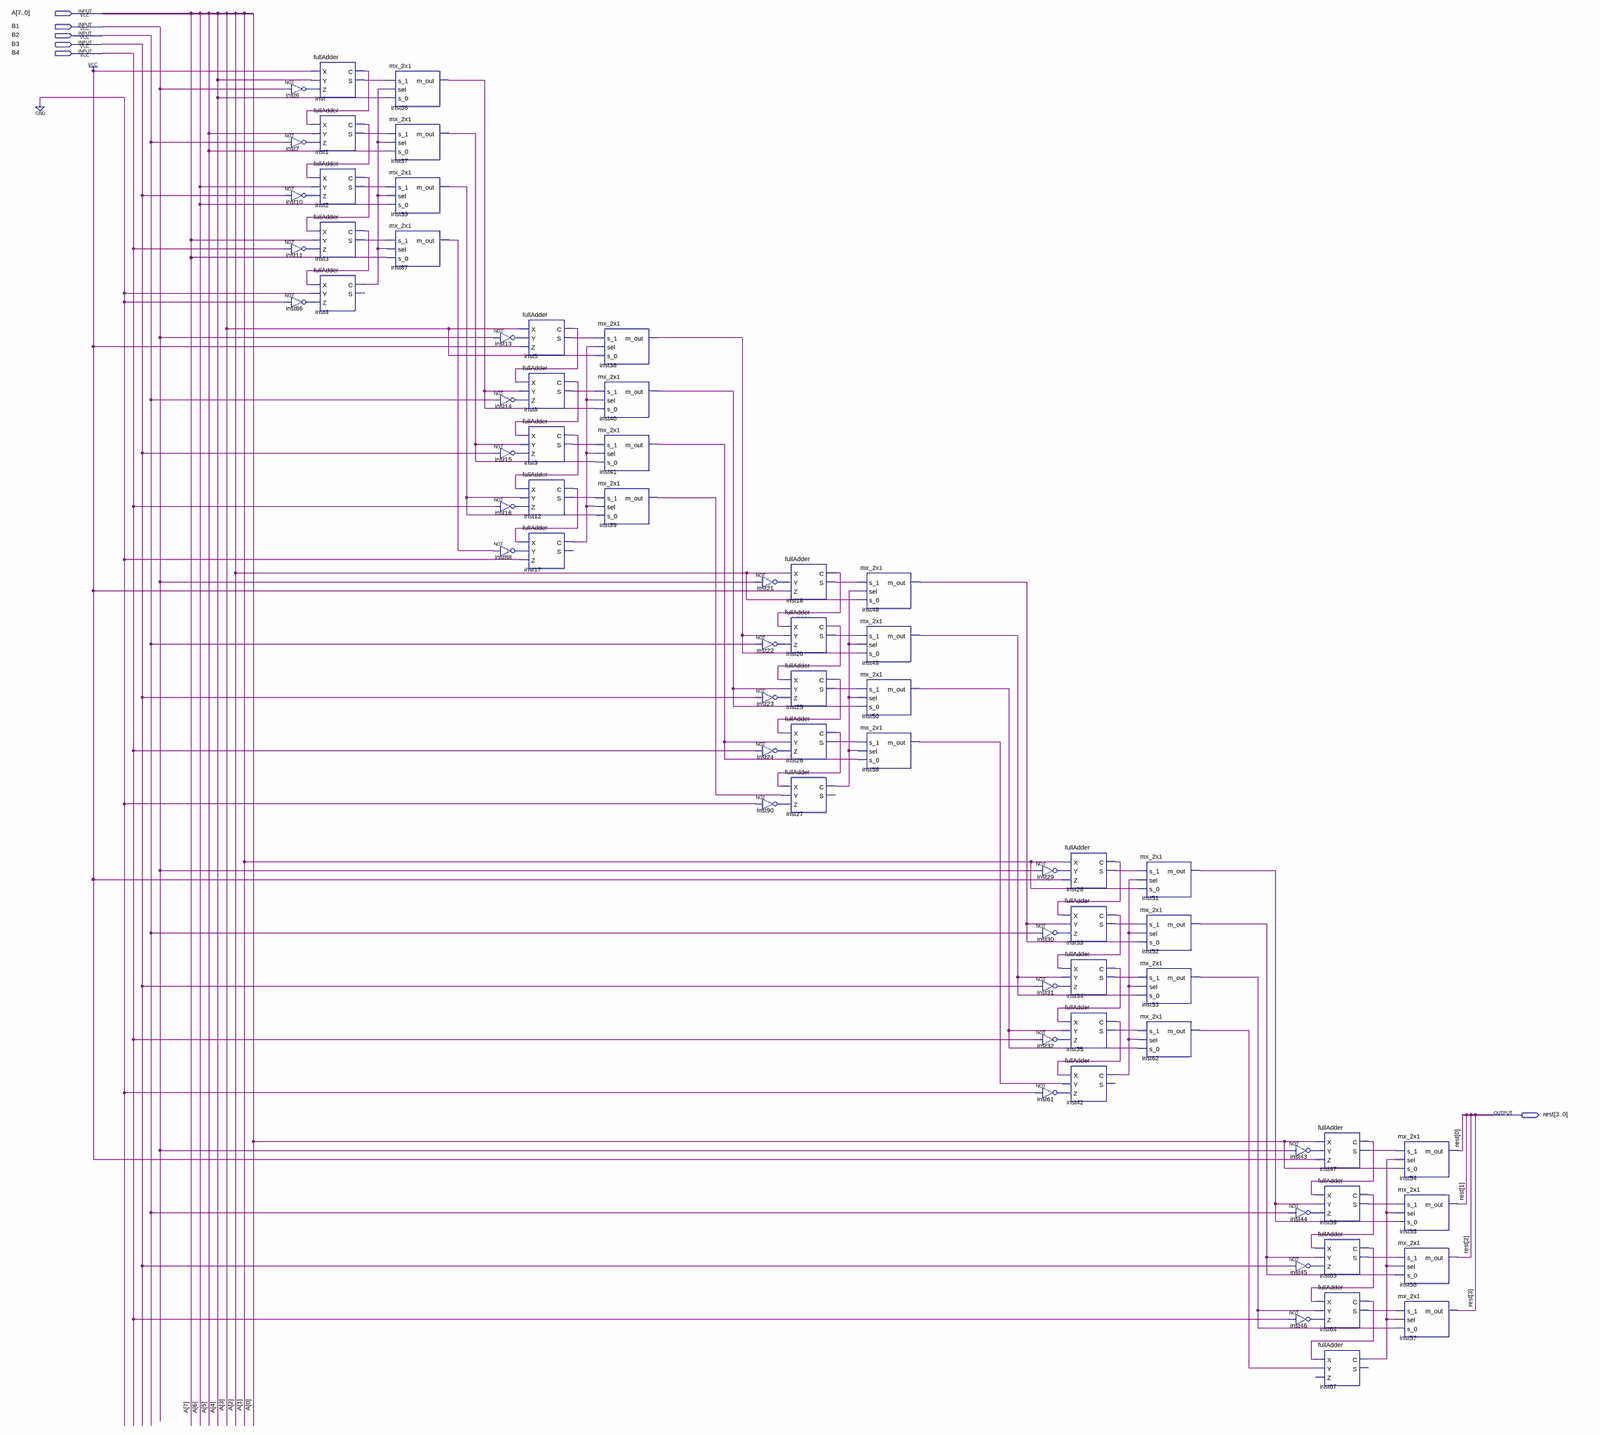
[diagram p0: schematic sheet, whole]
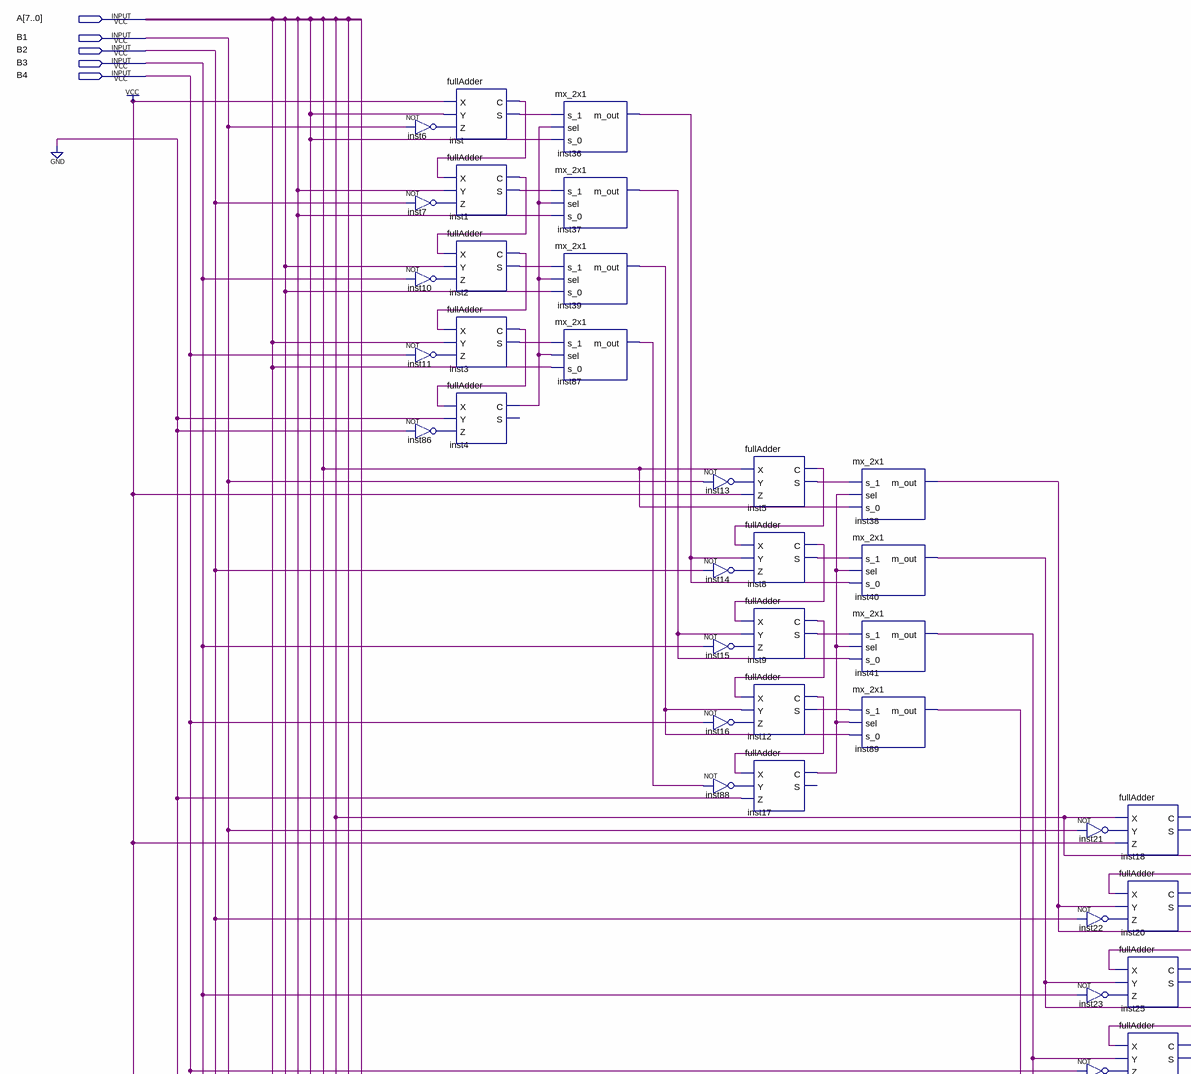
[diagram p1: schematic sheet, upper left part]
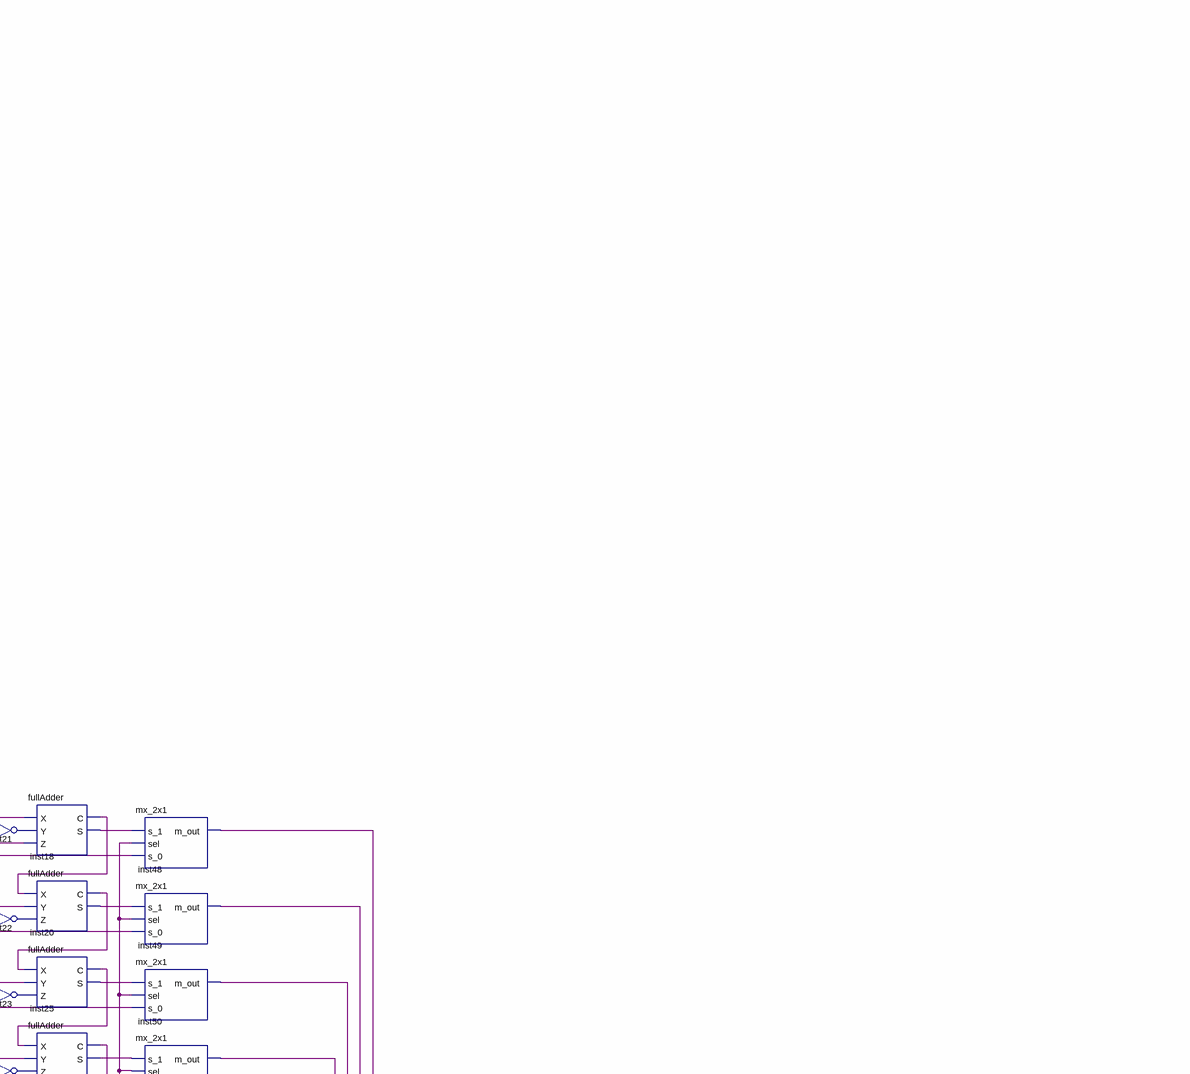
[diagram p2: schematic sheet, upper right part]
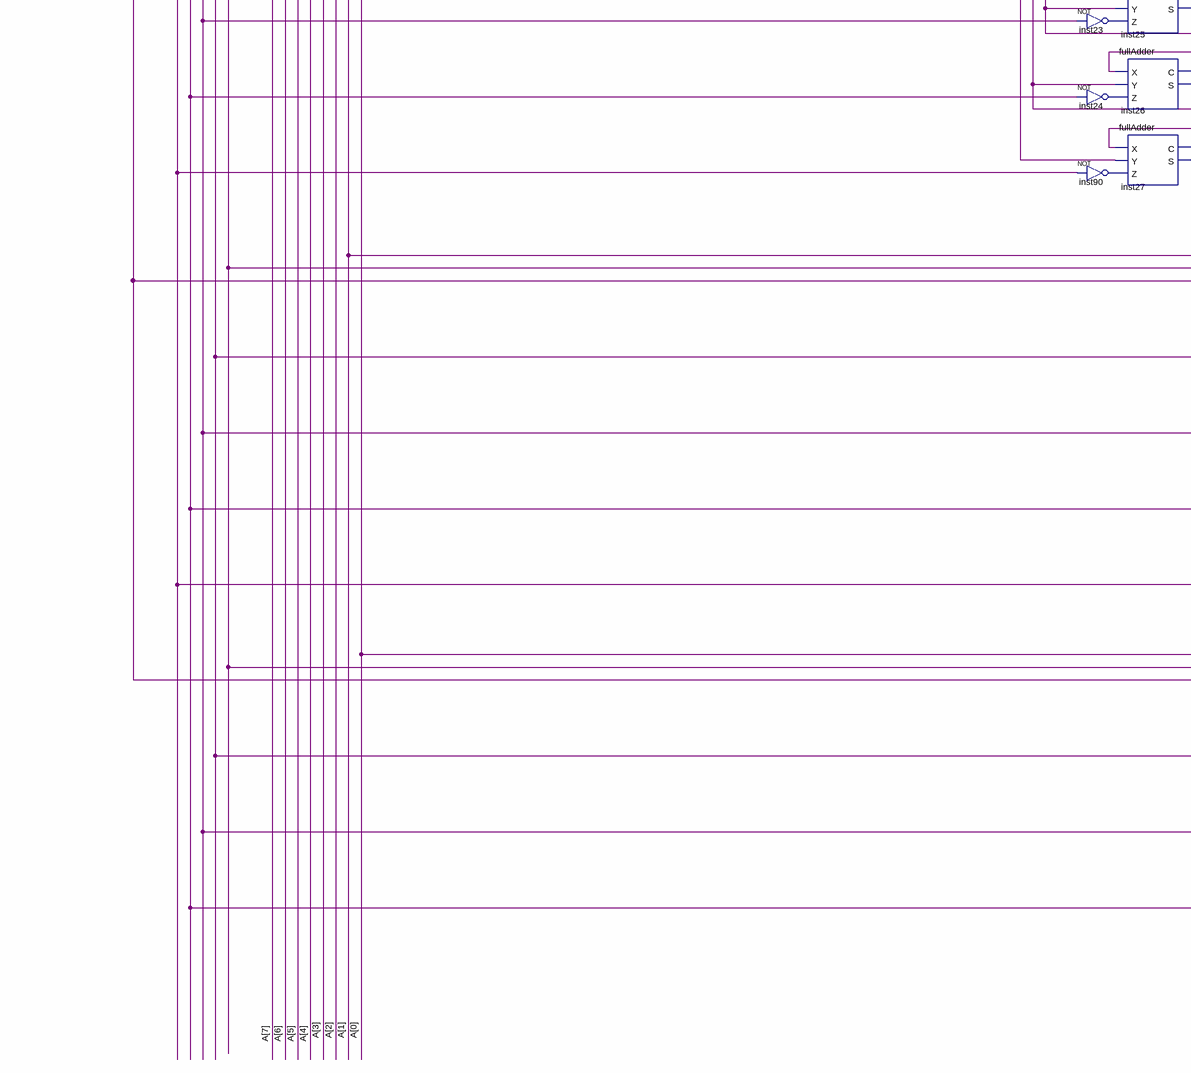
[diagram p3: schematic sheet, lower left part]
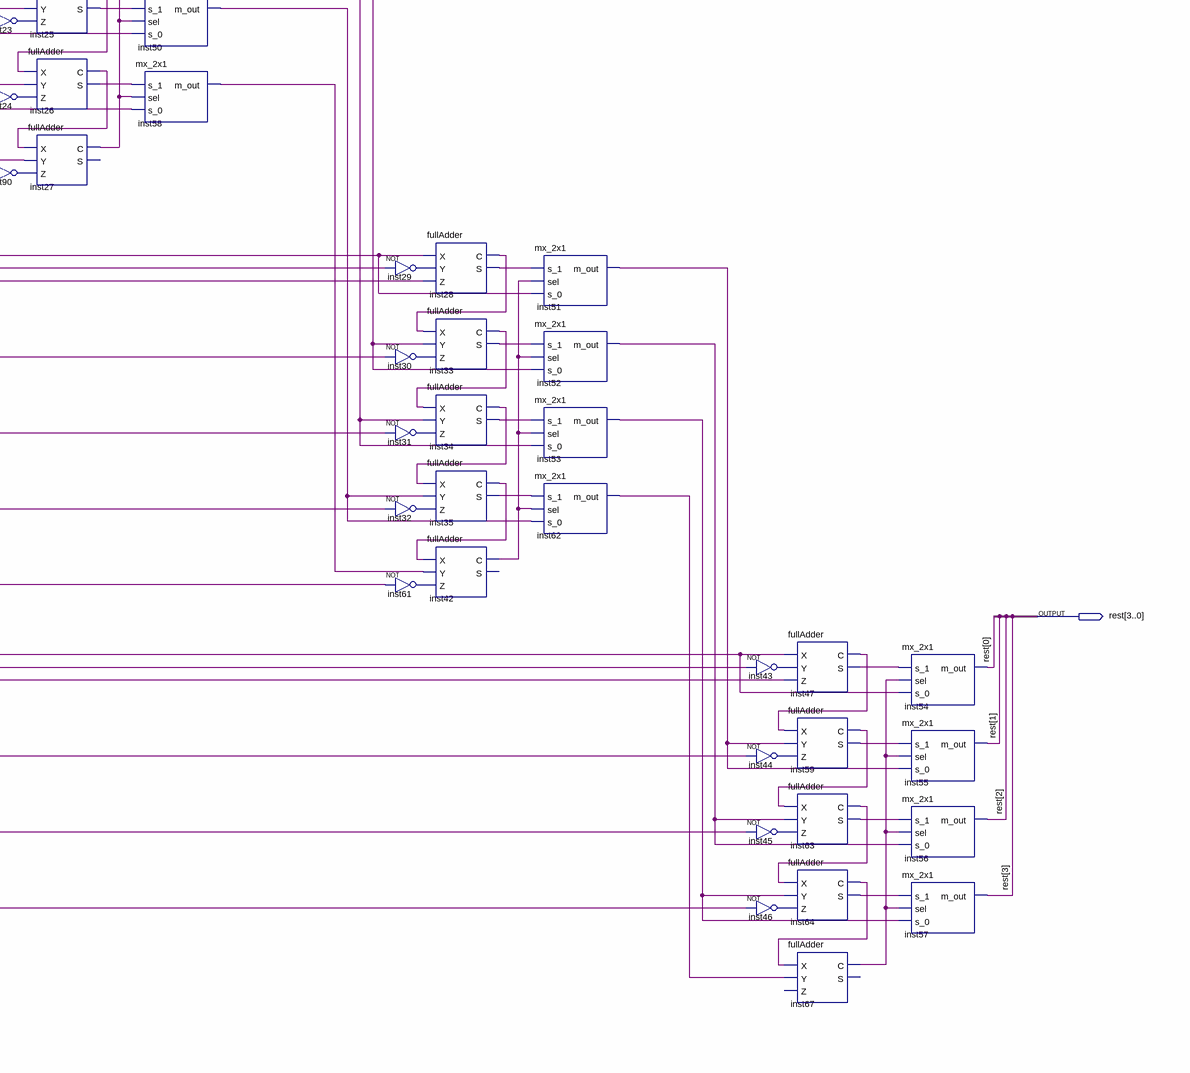
[diagram p4: schematic sheet, lower right part]
// Quartus schematic divEightFour.bdf as structural Verilog: 69 symbols, 6 pins
module divEightFour (
  input  [7:0] A,
  input  B1,
  input  B2,
  input  B3,
  input  B4,
  output [3:0] rest
);

  wire inst1_c, inst1_s, inst2_c, inst2_s, inst3_c, inst3_s, inst4_c, inst5_c, inst5_s, inst6_out, inst7_out,
       inst8_c, inst8_s, inst9_c, inst9_s, inst10_out, inst11_out, inst12_c, inst12_s, inst13_out,
       inst14_out, inst15_out, inst16_out, inst17_c, inst18_c, inst18_s, inst20_c, inst20_s, inst21_out,
       inst22_out, inst23_out, inst24_out, inst25_c, inst25_s, inst26_c, inst26_s, inst27_c, inst28_c,
       inst28_s, inst29_out, inst30_out, inst31_out, inst32_out, inst33_c, inst33_s, inst34_c, inst34_s,
       inst35_c, inst35_s, inst36_m_out, inst37_m_out, inst38_m_out, inst39_m_out, inst40_m_out,
       inst41_m_out, inst42_c, inst43_out, inst44_out, inst45_out, inst46_out, inst47_c, inst47_s,
       inst48_m_out, inst49_m_out, inst50_m_out, inst51_m_out, inst52_m_out, inst53_m_out, inst58_m_out,
       inst59_c, inst59_s, inst61_out, inst62_m_out, inst63_c, inst63_s, inst64_c, inst64_s, inst67_c,
       inst86_out, inst87_m_out, inst88_out, inst89_m_out, inst90_out, inst_c, inst_s;

  not inst6 (inst6_out, B1);
  not inst7 (inst7_out, B2);
  not inst10 (inst10_out, B3);
  not inst11 (inst11_out, B4);
  not inst86 (inst86_out, 1'b0);
  fullAdder inst (.X(1'b1), .Y(A[4]), .Z(inst6_out), .C(inst_c), .S(inst_s));
  fullAdder inst1 (.X(inst_c), .Y(A[5]), .Z(inst7_out), .C(inst1_c), .S(inst1_s));
  fullAdder inst2 (.X(inst1_c), .Y(A[6]), .Z(inst10_out), .C(inst2_c), .S(inst2_s));
  fullAdder inst3 (.X(inst2_c), .Y(A[7]), .Z(inst11_out), .C(inst3_c), .S(inst3_s));
  fullAdder inst4 (.X(inst3_c), .Y(1'b0), .Z(inst86_out), .C(inst4_c));  // open: S
  mx_2x1 inst36 (.s_1(inst_s), .sel(inst4_c), .s_0(A[4]), .m_out(inst36_m_out));
  mx_2x1 inst37 (.s_1(inst1_s), .sel(inst4_c), .s_0(A[5]), .m_out(inst37_m_out));
  mx_2x1 inst39 (.s_1(inst2_s), .sel(inst4_c), .s_0(A[6]), .m_out(inst39_m_out));
  mx_2x1 inst87 (.s_1(inst3_s), .sel(inst4_c), .s_0(A[7]), .m_out(inst87_m_out));
  fullAdder inst5 (.X(A[3]), .Y(inst13_out), .Z(1'b1), .C(inst5_c), .S(inst5_s));
  not inst13 (inst13_out, B1);
  fullAdder inst8 (.X(inst5_c), .Y(inst36_m_out), .Z(inst14_out), .C(inst8_c), .S(inst8_s));
  not inst14 (inst14_out, B2);
  fullAdder inst9 (.X(inst8_c), .Y(inst37_m_out), .Z(inst15_out), .C(inst9_c), .S(inst9_s));
  not inst15 (inst15_out, B3);
  fullAdder inst12 (.X(inst9_c), .Y(inst39_m_out), .Z(inst16_out), .C(inst12_c), .S(inst12_s));
  not inst16 (inst16_out, B4);
  fullAdder inst17 (.X(inst12_c), .Y(inst88_out), .Z(1'b0), .C(inst17_c));  // open: S
  not inst88 (inst88_out, inst87_m_out);
  mx_2x1 inst38 (.s_1(inst5_s), .sel(inst17_c), .s_0(A[3]), .m_out(inst38_m_out));
  mx_2x1 inst40 (.s_1(inst8_s), .sel(inst17_c), .s_0(inst36_m_out), .m_out(inst40_m_out));
  mx_2x1 inst41 (.s_1(inst9_s), .sel(inst17_c), .s_0(inst37_m_out), .m_out(inst41_m_out));
  mx_2x1 inst89 (.s_1(inst12_s), .sel(inst17_c), .s_0(inst39_m_out), .m_out(inst89_m_out));
  not inst21 (inst21_out, B1);
  not inst22 (inst22_out, B2);
  not inst23 (inst23_out, B3);
  not inst24 (inst24_out, B4);
  not inst90 (inst90_out, 1'b0);
  fullAdder inst18 (.X(A[2]), .Y(inst21_out), .Z(1'b1), .C(inst18_c), .S(inst18_s));
  fullAdder inst20 (.X(inst18_c), .Y(inst38_m_out), .Z(inst22_out), .C(inst20_c), .S(inst20_s));
  fullAdder inst25 (.X(inst20_c), .Y(inst40_m_out), .Z(inst23_out), .C(inst25_c), .S(inst25_s));
  fullAdder inst26 (.X(inst25_c), .Y(inst41_m_out), .Z(inst24_out), .C(inst26_c), .S(inst26_s));
  fullAdder inst27 (.X(inst26_c), .Y(inst89_m_out), .Z(inst90_out), .C(inst27_c));  // open: S
  mx_2x1 inst48 (.s_1(inst18_s), .sel(inst27_c), .s_0(A[2]), .m_out(inst48_m_out));
  mx_2x1 inst49 (.s_1(inst20_s), .sel(inst27_c), .s_0(inst38_m_out), .m_out(inst49_m_out));
  mx_2x1 inst50 (.s_1(inst25_s), .sel(inst27_c), .s_0(inst40_m_out), .m_out(inst50_m_out));
  mx_2x1 inst58 (.s_1(inst26_s), .sel(inst27_c), .s_0(inst41_m_out), .m_out(inst58_m_out));
  not inst29 (inst29_out, B1);
  not inst30 (inst30_out, B2);
  not inst31 (inst31_out, B3);
  not inst32 (inst32_out, B4);
  not inst61 (inst61_out, 1'b0);
  fullAdder inst28 (.X(A[1]), .Y(inst29_out), .Z(1'b1), .C(inst28_c), .S(inst28_s));
  fullAdder inst33 (.X(inst28_c), .Y(inst48_m_out), .Z(inst30_out), .C(inst33_c), .S(inst33_s));
  fullAdder inst34 (.X(inst33_c), .Y(inst49_m_out), .Z(inst31_out), .C(inst34_c), .S(inst34_s));
  fullAdder inst35 (.X(inst34_c), .Y(inst50_m_out), .Z(inst32_out), .C(inst35_c), .S(inst35_s));
  fullAdder inst42 (.X(inst35_c), .Y(inst58_m_out), .Z(inst61_out), .C(inst42_c));  // open: S
  mx_2x1 inst51 (.s_1(inst28_s), .sel(inst42_c), .s_0(A[1]), .m_out(inst51_m_out));
  mx_2x1 inst52 (.s_1(inst33_s), .sel(inst42_c), .s_0(inst48_m_out), .m_out(inst52_m_out));
  mx_2x1 inst53 (.s_1(inst34_s), .sel(inst42_c), .s_0(inst49_m_out), .m_out(inst53_m_out));
  mx_2x1 inst62 (.s_1(inst35_s), .sel(inst42_c), .s_0(inst50_m_out), .m_out(inst62_m_out));
  not inst43 (inst43_out, B1);
  not inst44 (inst44_out, B2);
  not inst45 (inst45_out, B3);
  not inst46 (inst46_out, B4);
  fullAdder inst47 (.X(A[0]), .Y(inst43_out), .Z(1'b1), .C(inst47_c), .S(inst47_s));
  fullAdder inst59 (.X(inst47_c), .Y(inst51_m_out), .Z(inst44_out), .C(inst59_c), .S(inst59_s));
  fullAdder inst63 (.X(inst59_c), .Y(inst52_m_out), .Z(inst45_out), .C(inst63_c), .S(inst63_s));
  fullAdder inst64 (.X(inst63_c), .Y(inst53_m_out), .Z(inst46_out), .C(inst64_c), .S(inst64_s));
  fullAdder inst67 (.X(inst64_c), .Y(inst62_m_out), .C(inst67_c));  // open: Z, S
  mx_2x1 inst54 (.s_1(inst47_s), .sel(inst67_c), .s_0(A[0]), .m_out(rest[0]));
  mx_2x1 inst55 (.s_1(inst59_s), .sel(inst67_c), .s_0(inst51_m_out), .m_out(rest[1]));
  mx_2x1 inst56 (.s_1(inst63_s), .sel(inst67_c), .s_0(inst52_m_out), .m_out(rest[2]));
  mx_2x1 inst57 (.s_1(inst64_s), .sel(inst67_c), .s_0(inst53_m_out), .m_out(rest[3]));
endmodule
